# Altium schematic sheet SensorADC.SchDoc
size A; SheetNumber: 5; SheetTotal: 8
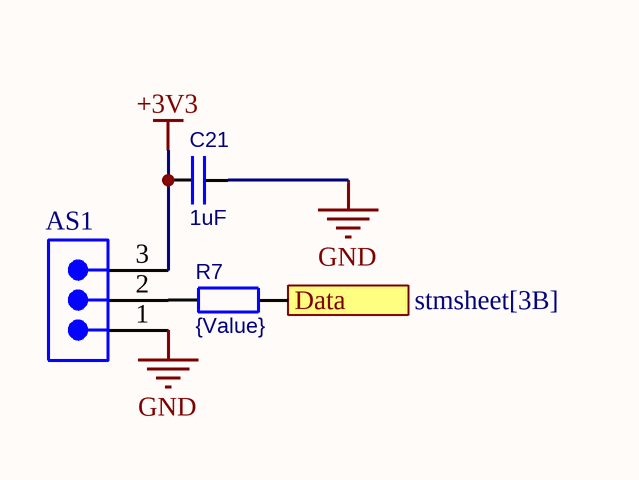
[diagram p0: SensorADC.SchDoc]

## Parts
AS1  (no value)  [691321100003]
C21  1uF  [C0603]
R7  {Value}  [R0603]

## Ports
Data (out, see stmsheet[3B])

## Nets
+3V3: AS1.3 C21.1
GND: AS1.1 C21.2
Data: R7.2 ; port Data
NetAS1_2: AS1.2 R7.1

## Library data of the parts
AS1 = CMP-1502-01784-2: NexarPartId: 18818341; Pitch: 3.5052mm; Current Rating: 10.5A; Number of Positions Per Level: 3; Current: 10A; Voltage: 300V; Gender: Male; Number of Levels: 1; REACH SVHC: Unknown; Height: 12.7mm; Mount: Through Hole; RoHS: Compliant; Contact Gender: Male; Lead Free: Lead Free; Lead Pitch: 3.5mm; Orientation: Vertical; Width: 15.1mm; Color: Green; Number of Contacts: 3; Number of Rows: 1; Length: 7mm; Number of Pins: 3; Termination: Solder; Packaging: Box; Contact Material: Brass
C21 = C: Capacitor; Value: 1uF
R7 = R: Value: {Value}